# EAGLE schematic ultimatedrive_2 (EAGLE 9.6.0)
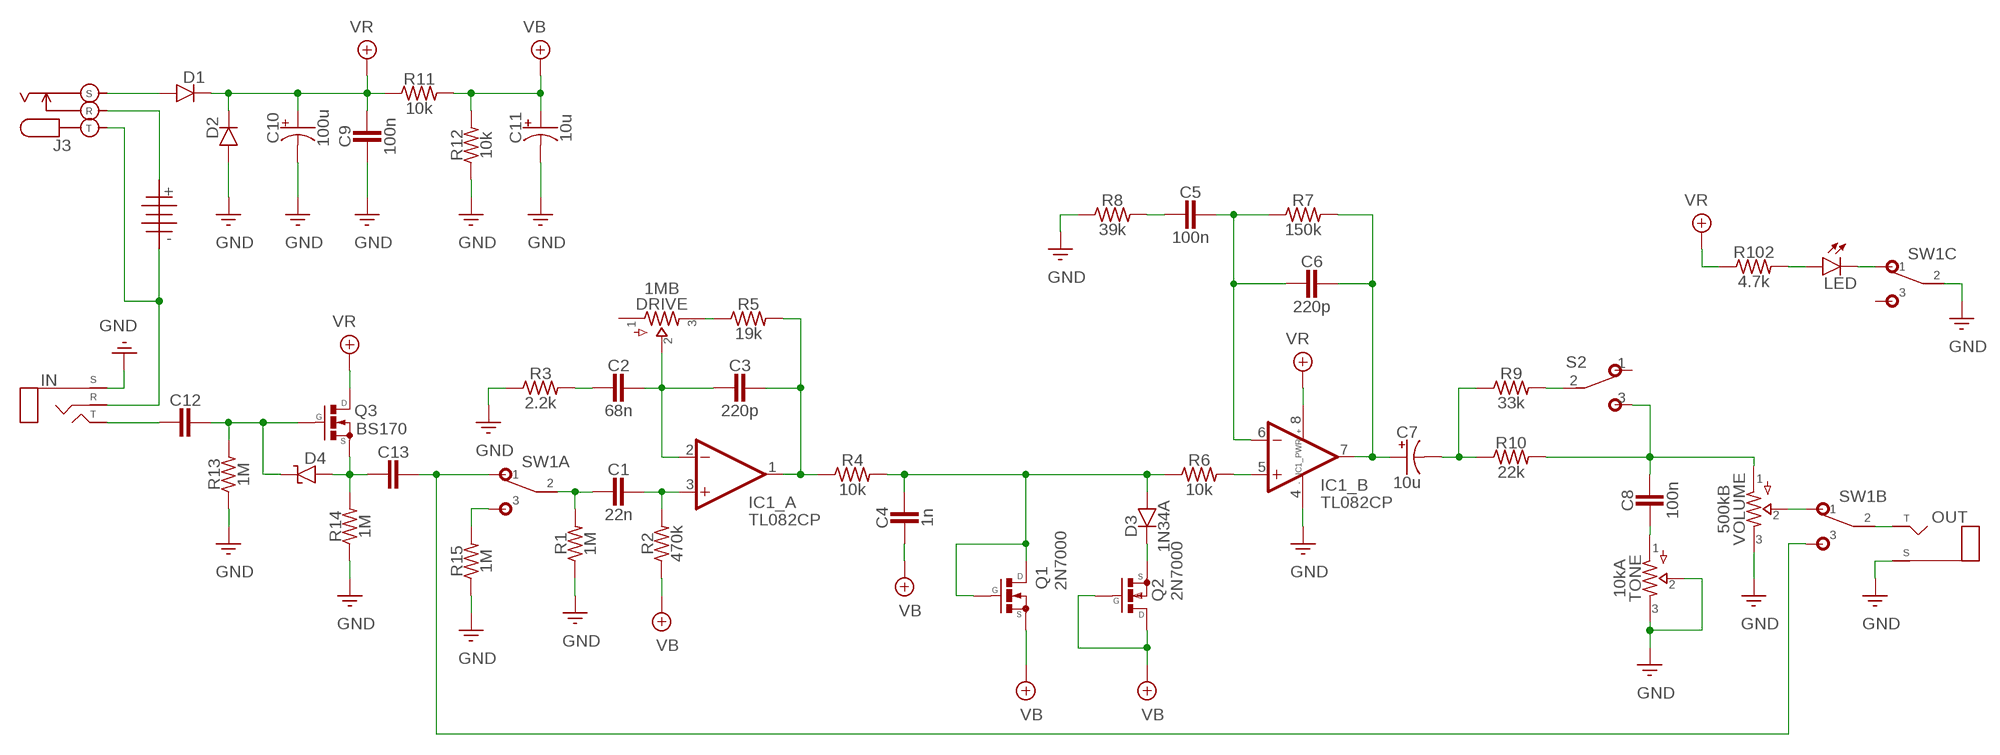
[diagram p0: schematic, sheet 1]

## Parts
1  BATTERY  [TWO_PADS]
C1  22n  CER/FILMBOX.1  [BOX_SMALL]
C2  68n  CER/FILMBOX.1  [BOX_SMALL]
C3  220p  CER/FILMBOX.1  [BOX_SMALL]
C4  1n  CER/FILMBOX.1  [BOX_SMALL]
C5  100n  CER/FILMBOX.1  [BOX_SMALL]
C6  220p  CER/FILMBOX.1  [BOX_SMALL]
C7  10u  0500  [050_020]
C8  100n  CER/FILMBOX.1  [BOX_SMALL]
C9  100n  CER/FILMBOX.1  [BOX_SMALL]
C10  100u  0500  [050_020]
C11  10u  0500  [050_020]
C12  CER/FILMBOX.1  [BOX_SMALL]
C13  CER/FILMBOX.1  [BOX_SMALL]
D1  DO41.3  [DO41-3]
D2  DO41.3  [DO41-3]
D3  1N34A  DO41.2  [DO41-2]
D4  ZENER.3  [DO41-3]
DRIVE  1MB  POTS16MM  [16MM]
IC1  TL082CP  DUALTH  [DIL0]
IN  STEREO  [STEREO_PCB]
J3  DC_KOBICONN  [DC_KOBICONN]
LED  LED  [3MM_D]
OUT  MONO  [TWO_PADS]
Q1  2N7000  [TO92-]
Q2  2N7000  [TO92-]
Q3  BS170  [SOT54ES]
R1  1M  R_.3B  [R0207/3]
R2  470k  R_.3B  [R0207/3]
R3  2.2k  R_.3B  [R0207/3]
R4  10k  R_.3B  [R0207/3]
R5  19k  R_.3B  [R0207/3]
R6  10k  R_.3B  [R0207/3]
R7  150k  R_.3B  [R0207/3]
R8  39k  R_.3B  [R0207/3]
R9  33k  R_.3B  [R0207/3]
R10  22k  R_.3B  [R0207/3]
R11  10k  R_.3B  [R0207/3]
R12  10k  R_.3B  [R0207/3]
R13  1M  R_.3B  [R0207/3]
R14  1M  R_.3B  [R0207/3]
R15  1M  R_.3B  [R0207/3]
R102  4.7k  R_.3B  [R0207/3]
S2  SPDT  [M9040P]
SW1  3PDT  [3PDT]
TONE  10kA  POTS16MM  [16MM]
VOLUME  500kB  POTS16MM  [16MM]

## Nets
GND: C9.2 C10.- C11.- D2.A IC1.4(_PWR:V-) IN.P$1(S) OUT.S(SLEEVE) R1.1 R3.1 R8.1 R12.1 R13.1 R14.1 R15.1 SW1.C2 TONE.2 TONE.3 VOLUME.3
N$1: C7.- R9.1 R10.1
N$2: C8.2 TONE.1
N$3: C1.2 R1.2 SW1.A2
N$4: C1.1 IC1.3(_A:+IN) R2.2
N$5: C2.1 C3.2 DRIVE.2 IC1.2(_A:-IN)
N$6: DRIVE.3 R5.1
N$7: C3.1 IC1.1(_A:OUT) R4.1 R5.2
N$8: C2.2 R3.2
N$9: IC1.5(_B:+IN) R6.2
N$10: D3.C Q2.3(S)
N$11: C4.1 D3.A Q1.1(D) Q1.2(G) R4.2 R6.1
N$12: C5.1 C6.2 IC1.6(_B:-IN) R7.1
N$13: C6.1 C7.+ IC1.7(_B:OUT) R7.2
N$14: C5.2 R8.2
N$15: R9.2 S2.2(P)
N$16: C8.1 R10.2 S2.3(S) VOLUME.1
N$17: D1.A J3.S
N$18: 1.T J3.R
N$19: 1.S IN.P$2(R) J3.T
N$20: C12.2 IN.P$3(T)
N$21: C12.1 D4.C Q3.G R13.2
N$22: R15.2 SW1.A3
N$23: C13.2 D4.A Q3.S R14.2
N$24: C13.1 SW1.A1 SW1.B3
N$25: SW1.B1 VOLUME.2
N$26: OUT.T(TIP) SW1.B2
N$27: LED.ANODE(A) R102.2
N$28: LED.P$1(C) SW1.C1
VB: C4.2 C11.+ Q1.3(S) Q2.1(D) Q2.2(G) R2.1 R11.2 R12.2
VR: C9.1 C10.+ D1.C D2.C IC1.8(_PWR:V+) Q3.D R11.1 R102.1
Unconnected: DRIVE.1 S2.1(O) SW1.C3

## Library data of the parts
1 = pedals-jacks:BATTERY
C1-C6 C8 C9 C12 C13 = pedals-capacitors-film:CER/FILM: 47 - 120pF Xicon Ceramic Disc 2.5mm lead spacing
C7 C10 C11 = pedals-capacitors-elec:050
D1-D3 = pedals-diodes:DO41: DO-41 Package Diodes: 1N4001 - 1N40019 Zener Diodes: 1N4728 - 1N4764
D4 = pedals-diodes:ZENER
DRIVE TONE VOLUME = pedals-potentiometers:POTS
IC1 = pedals-integrated circuits:DUAL: OP AMP
IN = pedals-jacks:STEREO
J3 = pedals-jacks:DC_KOBICONN
LED = pedals-diodes:LED
OUT = pedals-jacks:MONO: Mono 1/4" Phone Jack
Q1 Q2 = pedals-transistors:2N7000
Q3 = pedals-transistors:BS170: N-CHANNEL MOS FET
R1-R15 R102 = pedals-resistors:R_
S2 = pedals-switches:SPDT: TOGGLE SWITCH Marquardt
SW1 = pedals-switches:3PDT